# Altium schematic sheet UserControlInterface.SchDoc
size A4
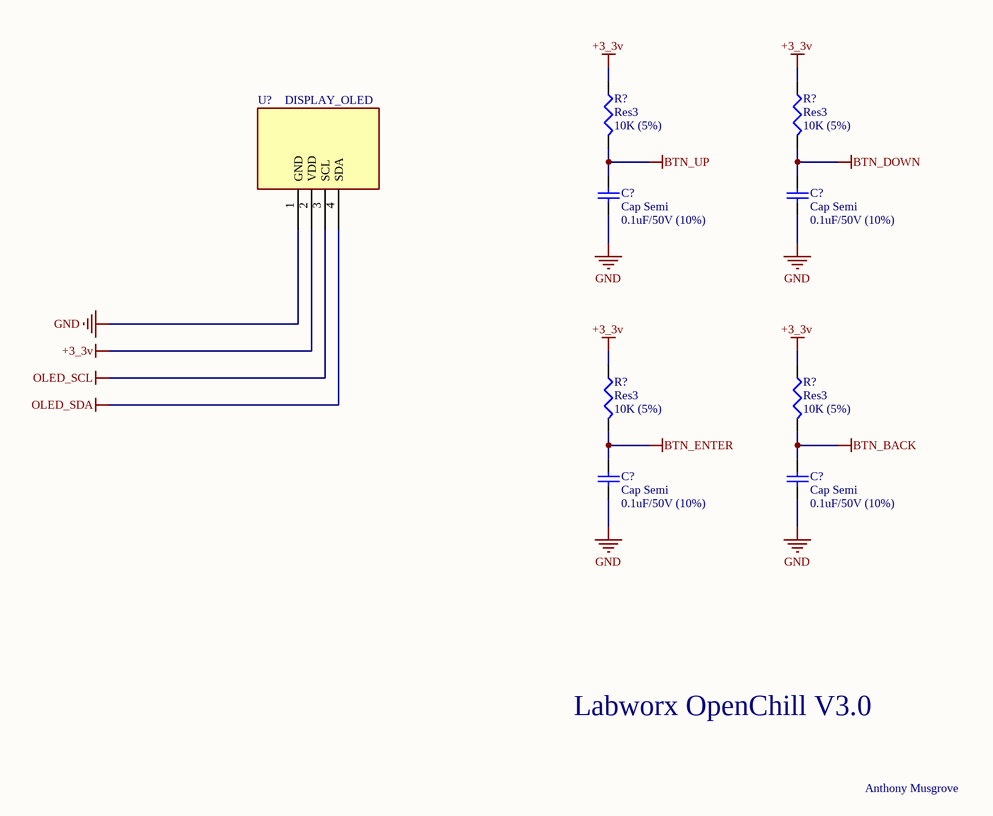
[diagram p0: UserControlInterface.SchDoc]

## Parts
(Parts that share a designator on the sheet are numbered #1, #2 ... from top to bottom, then left to right.)
C?#1  Cap Semi  value 0.1uF/50V (10%)  [1608[0603]]
C?#2  Cap Semi  value 0.1uF/50V (10%)  [1608[0603]]
C?#3  Cap Semi  value 0.1uF/50V (10%)  [1608[0603]]
C?#4  Cap Semi  value 0.1uF/50V (10%)  [1608[0603]]
R?#1  Res3  value 10K (5%)  [J1-0603]
R?#2  Res3  value 10K (5%)  [J1-0603]
R?#3  Res3  value 10K (5%)  [J1-0603]
R?#4  Res3  value 10K (5%)  [J1-0603]
U?  DISPLAY_OLED  [DISPLAY_OLED]

## Nets
+3_3v: R?#1.1 R?#2.1 R?#3.1 R?#4.1 U?.2(VDD)
BTN_BACK: C?#4.2 R?#4.2
BTN_DOWN: C?#2.2 R?#2.2
BTN_ENTER: C?#3.2 R?#3.2
BTN_UP: C?#1.2 R?#1.2
GND: C?#1.1 C?#2.1 C?#3.1 C?#4.1 U?.1(GND)
OLED_SCL: U?.3(SCL)
OLED_SDA: U?.4(SDA)

## Notes on the sheet
- Labworx OpenChill V3.0
- Anthony Musgrove

## Library data of the parts
C?#1-C?#4 = Cap Semi: Capacitor (Semiconductor SIM Model); Published: 8-Jun-2000; LatestRevisionDate: 29-May-2009; LatestRevisionNote: IPC-7351 Footprint Added.; PackageReference: C1206; Publisher: Altium Limited; PackageDescription: Chip Capacitor
R?#1-R?#4 = Res3: Resistor; Published: 8-Jun-2000; LatestRevisionDate: 29-May-2009; LatestRevisionNote: IPC-7351 Footprint Added.; PackageReference: J1-0603; Publisher: Altium Limited; PackageDescription: Chip Resistor
U? = DISPLAY_OLED: Display Oled 128x64 0.96" I2C.